# EAGLE design preamp (EAGLE 7.3.0)
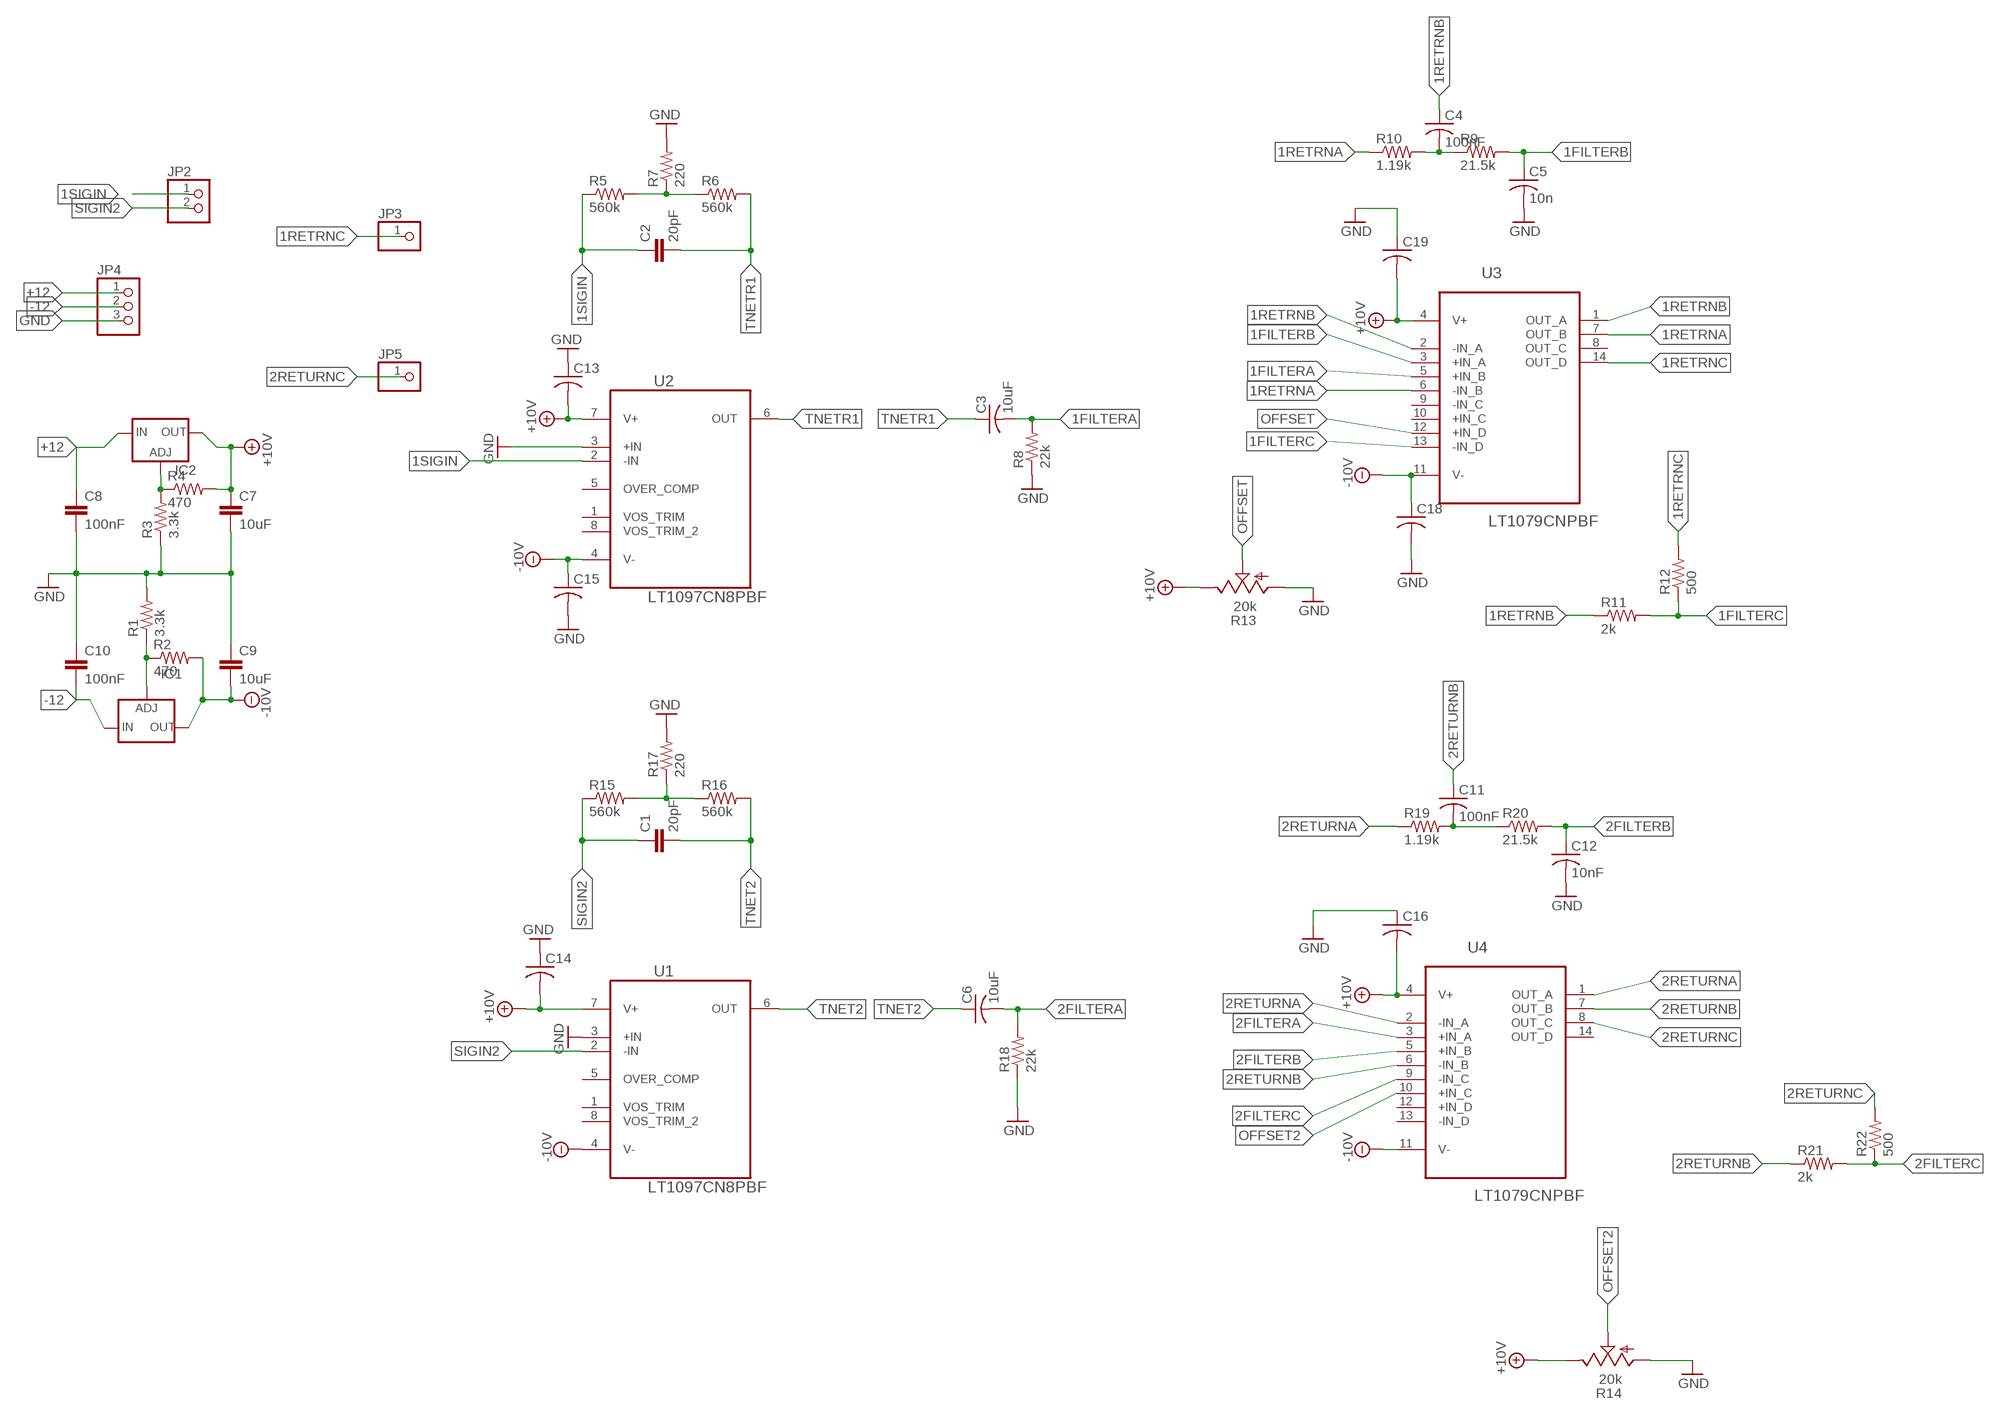
[diagram p0: schematic, sheet 1]

## Parts
C1  20pF  C-EU025-030X050  [C025-030X050]
C2  20pF  C-EU025-030X050  [C025-030X050]
C3  10uF  C-US050-030X075  [C050-030X075]
C4  100nF  C-US050-024X044  [C050-024X044]
C5  10n  C-US025-024X044  [C025-024X044]
C6  10uF  C-US050-030X075  [C050-030X075]
C7  10uF  C-EU025-025X050  [C025-025X050]
C8  100nF  C-EU025-025X050  [C025-025X050]
C9  10uF  C-EU025-025X050  [C025-025X050]
C10  100nF  C-EU025-025X050  [C025-025X050]
C11  100nF  C-US050-024X044  [C050-024X044]
C12  10nF  C-US025-024X044  [C025-024X044]
C13  C-US025-024X044  [C025-024X044]
C14  C-US025-024X044  [C025-024X044]
C15  C-US025-024X044  [C025-024X044]
C16  C-US025-024X044  [C025-024X044]
C18  C-US025-024X044  [C025-024X044]
C19  C-US025-024X044  [C025-024X044]
IC1  LM337TS  [337TS]
IC2  LM317TS  [317TS]
JP2  PINHD-1X2  [1X02]
JP3  PINHD-1X1  [1X01]
JP4  PINHD-1X3  [1X03]
JP5  PINHD-1X1  [1X01]
R1  3.3k  R-US_0204/5  [0204/5]
R2  470  R-US_0204/5  [0204/5]
R3  3.3k  R-US_0204/5  [0204/5]
R4  470  R-US_0204/5  [0204/5]
R5  560k  R-US_0204/7  [0204/7]
R6  560k  R-US_0204/7  [0204/7]
R7  220  R-US_0204/7  [0204/7]
R8  22k  R-US_0204/5  [0204/5]
R9  21.5k  R-US_0204/5  [0204/5]
R10  1.19k  R-US_0204/5  [0204/5]
R11  2k  R-US_0204/5  [0204/5]
R12  500  R-US_0204/5  [0204/5]
R13  20k  TRIM_US-B64W  [B64W]
R14  20k  TRIM_US-B64W  [B64W]
R15  560k  R-US_0204/7  [0204/7]
R16  560k  R-US_0204/7  [0204/7]
R17  220  R-US_0204/7  [0204/7]
R18  22k  R-US_0204/5  [0204/5]
R19  1.19k  R-US_0204/5  [0204/5]
R20  21.5k  R-US_0204/5  [0204/5]
R21  2k  R-US_0204/5  [0204/5]
R22  500  R-US_0204/5  [0204/5]
U1  LT1097CN8PBF  [DIP254P762X393-8]
U2  LT1097CN8PBF  [DIP254P762X393-8]
U3  LT1079CNPBF  [DIP254P762X394-14]
U4  LT1079CNPBF  [DIP254P762X394-14]

## Nets
1FILTERA: C3.2 R8.2 U3.5(+IN_B)
1FILTERB: C5.1 R9.2 U3.3(+IN_A)
1FILTERC: R11.2 R12.1 U3.13(-IN_D)
1RETRNA: R10.1 U3.6(-IN_B) U3.7(OUT_B)
1RETRNB: C4.1 R11.1 U3.1(OUT_A) U3.2(-IN_A)
1RETRNC: JP3.1 R12.2 U3.14(OUT_D)
1SIGIN: C2.1 JP2.1 R5.1 U2.2(-IN)
2FILTERA: C6.2 R18.2 U4.3(+IN_A)
2FILTERB: C12.1 R20.2 U4.5(+IN_B)
2FILTERC: R21.2 R22.1 U4.9(-IN_C)
2RETURNA: R19.1 U4.1(OUT_A) U4.2(-IN_A)
2RETURNB: C11.1 R21.1 U4.6(-IN_B) U4.7(OUT_B)
2RETURNC: JP5.1 R22.2 U4.8(OUT_C)
+10V: C7.1 C13.2 C14.2 C16.2 C19.2 IC2.2(OUT) R4.2 R13.E R14.E U1.7(V+) U2.7(V+) U3.4(V+) U4.4(V+)
+12: C8.1 IC2.3(IN) JP4.1
-10V: C9.2 C15.1 C18.1 IC1.3(OUT) R2.2 U1.4(V-) U2.4(V-) U3.11(V-) U4.11(V-)
-12: C10.2 IC1.2(IN) JP4.2
GND: C5.2 C7.2 C8.2 C9.1 C10.1 C12.2 C13.1 C14.1 C15.2 C16.1 C18.2 C19.1 JP4.3 R1.2 R3.1 R7.2 R8.1 R13.A R14.A R17.2 R18.1 U1.3(+IN) U2.3(+IN)
N$1: IC2.1(ADJ) R3.2 R4.1
N$2: IC1.1(ADJ) R1.1 R2.1
N$3: R5.2 R6.1 R7.1
N$4: C4.2 R9.1 R10.2
N$5: R15.2 R16.1 R17.1
N$19: C11.2 R19.2 R20.1
OFFSET: R13.S U3.12(+IN_D)
OFFSET2: R14.S U4.10(+IN_C)
SIGIN2: C1.1 JP2.2 R15.1 U1.2(-IN)
TNET2: C1.2 C6.1 R16.2 U1.6(OUT)
TNETR1: C2.2 C3.1 R6.2 U2.6(OUT)
Unconnected: U1.1(VOS_TRIM) U1.5(OVER_COMP) U1.8(VOS_TRIM_2) U2.1(VOS_TRIM) U2.5(OVER_COMP) U2.8(VOS_TRIM_2) U3.8(OUT_C) U3.9(-IN_C) U3.10(+IN_C) U4.12(+IN_D) U4.13(-IN_D) U4.14(OUT_D)

## Library data of the parts
C1 C2 C7-C10 = resistor:C-EU: CAPACITOR, European symbol
C3-C6 C11 C12 = resistor:C-US: CAPACITOR, American symbol
C13-C16 C18 C19 = rcl:C-US: CAPACITOR, American symbol
IC1 = v-reg:LM337TS: VOLTAGE REGULATOR
IC2 = v-reg:LM317TS: VOLTAGE REGULATOR
JP2 = pinhead:PINHD-1X2: PIN HEADER
JP3 JP5 = pinhead:PINHD-1X1: PIN HEADER
JP4 = pinhead:PINHD-1X3: PIN HEADER
R1-R12 R15-R22 = resistor:R-US_: RESISTOR, American symbol
R13 R14 = pot:TRIM_US-: POTENTIOMETER
U1 U2 = LTC_By_element14_Batch_1:LT1097CN8PBF: Precision Op Amp; MPN: LT1097CN8#PBF; OC_FARNELL: 9559914; OC_NEWARK: 57M1574; PACKAGE: PDIP; SUPPLIER: LINEAR TECHNOLOGY
U3 U4 = LTC_By_element14_Batch_1:LT1079CNPBF: Precision Op Amps; MPN: LT1079CN#PBF; OC_FARNELL: 9559701; OC_NEWARK: 57M1426; PACKAGE: PDIP-14; SUPPLIER: Linear Technology

## Board
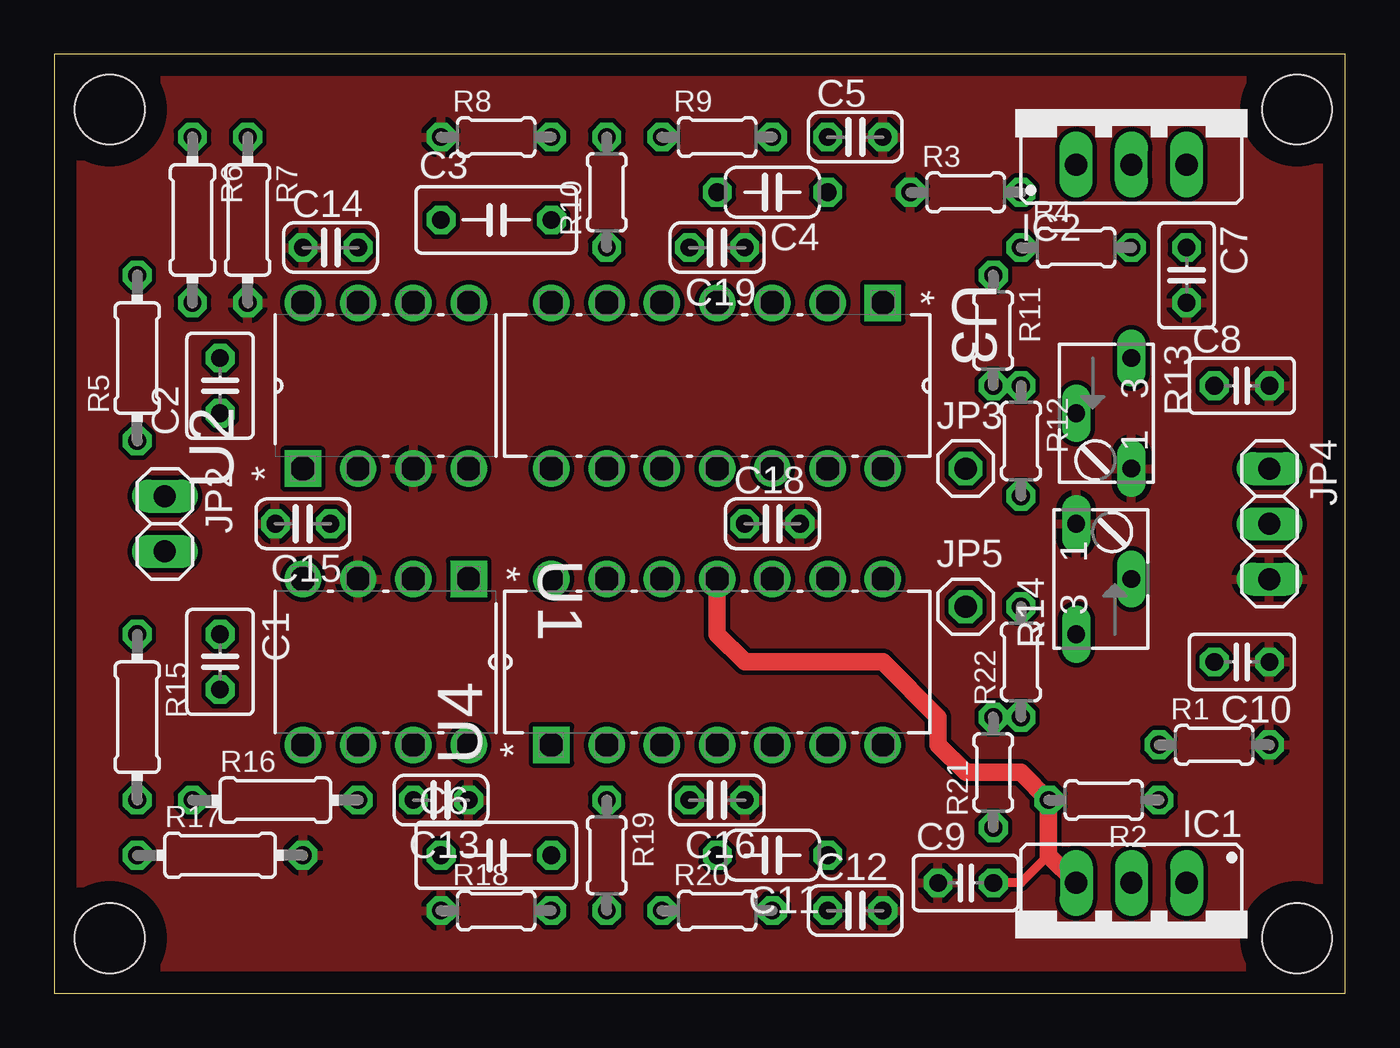
[diagram p1: board, top side]
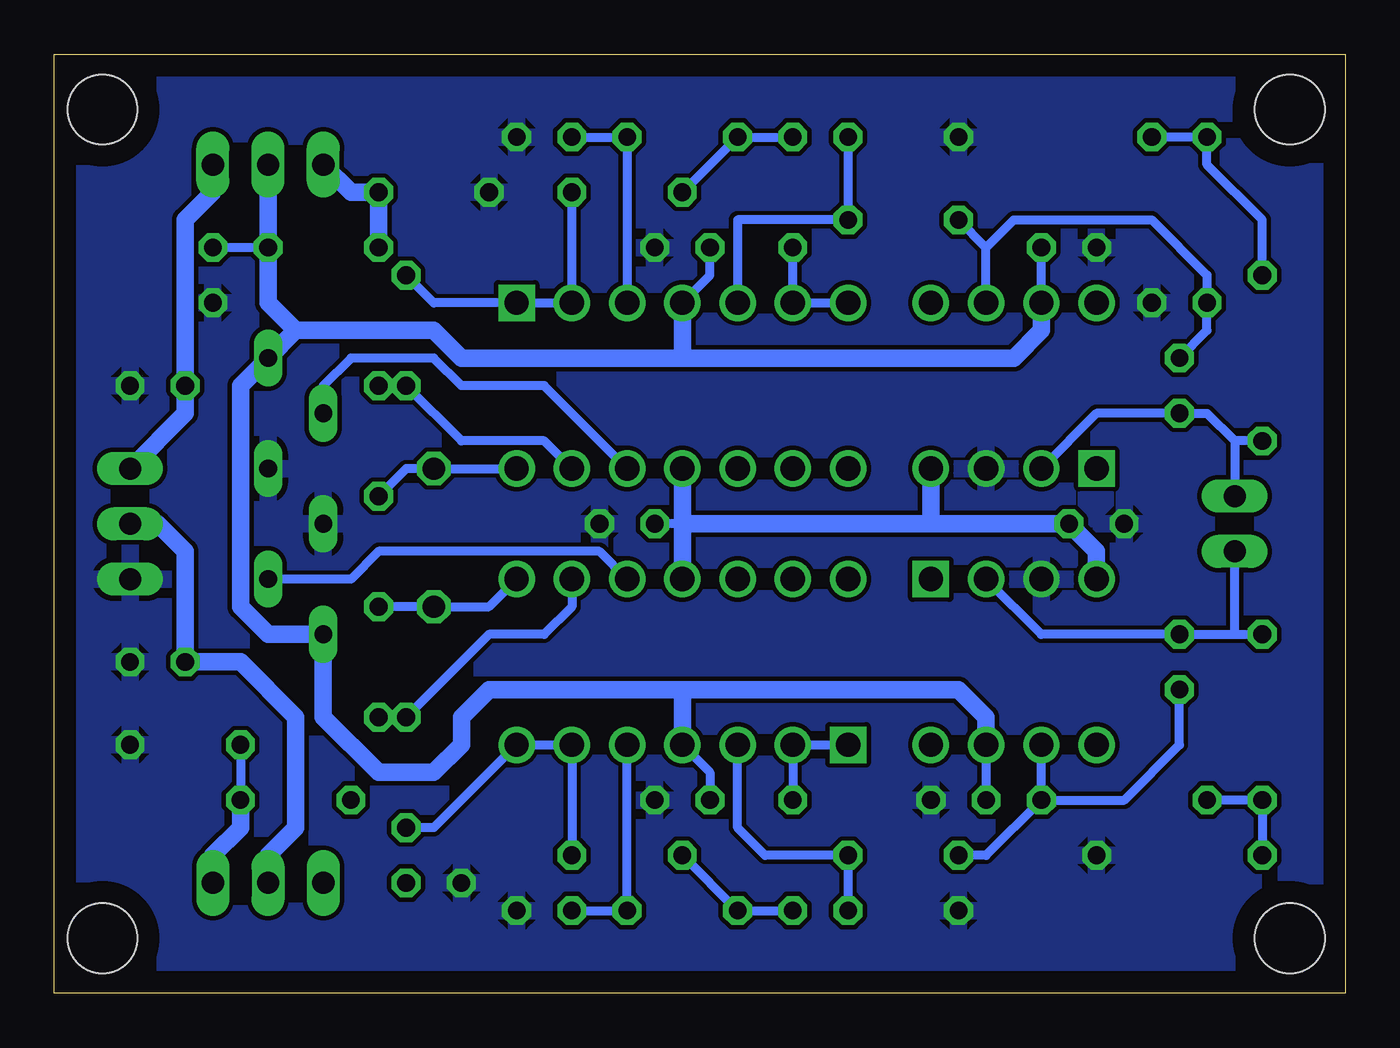
[diagram p2: board, bottom side, seen from below]

Size 59.36 x 43.17 mm. Coordinates in mm from the lower left corner, seen from the top.
Outline: 0,0 59.36,0 59.36,43.17 0,43.17 0,0
Copper layers (1*16): Top 0.035mm / dielectric 1.5mm / Bottom 0.035mm
Design rules "default *": minimum track width 16mil, minimum drill 24mil, track to track 8mil, track to pad 8mil, pad to pad 8mil, via to via 8mil, smd to smd 8mil, copper to edge 40mil, drill to drill 8mil, minimum pad ring 10mil, minimum via ring 8mil, stop-mask expansion 4mil, vias tented up to drill 0mil, thermal gap 10mil
Holes 3.2 mm at 2.54,40.64 57.15,40.64 57.15,2.54 2.54,2.54

### Footprints (pad centres in the part's own frame; a part is rotated, then mirrored left to right if it is on the bottom)
C025-030X050 = drill 0.813 octagon: 1 -1.27,0; 2 1.27,0
C050-030X075 = drill 0.813 octagon: 1 -2.54,0; 2 2.54,0
C050-024X044 = drill 0.813 octagon: 1 -2.54,0; 2 2.54,0
C025-024X044 = drill 0.813 octagon: 1 -1.27,0; 2 1.27,0
C025-025X050 = drill 0.813 octagon: 1 -1.27,0; 2 1.27,0
337TS = drill 1.016 long: 1 -2.54,-2.54; 2 0,-2.54; 3 2.54,-2.54
317TS = drill 1.016 long: 1 -2.54,-2.54; 2 0,-2.54; 3 2.54,-2.54
1X02 = drill 1.016 long: 1 -1.27,0; 2 1.27,0
1X01 = drill 1.016 octagon: 1 0,0
1X03 = drill 1.016 long: 1 -2.54,0; 2 0,0; 3 2.54,0
0204/5 = drill 0.813 octagon: 1 -2.54,0; 2 2.54,0
0204/7 = drill 0.813 octagon: 1 -3.81,0; 2 3.81,0
B64W = drill 0.813 long: A 2.54,0; E -2.54,0; S 0,-2.54
DIP254P762X393-8 = drill 1.118 square: 1 -7.62,7.62 | drill 1.118: 2 -7.62,5.08; 3 -7.62,2.54; 4 -7.62,0; 5 0,0; 6 0,2.54; 7 0,5.08; 8 0,7.62
DIP254P762X394-14 = drill 1.118 square: 1 -7.62,15.24 | drill 1.118: 2 -7.62,12.7; 3 -7.62,10.16; 4 -7.62,7.62; 5 -7.62,5.08; 6 -7.62,2.54; 7 -7.62,0; 8 0,0; 9 0,2.54; 10 0,5.08; 11 0,7.62; 12 0,10.16; 13 0,12.7; 14 0,15.24

### Placement (x,y rotation side)
C1  7.62,15.24 270 top
C2  7.62,27.94 90 top
C3  20.32,35.56 0 top
C4  33.02,36.83 180 top
C5  36.83,39.37 0 top
C6  20.32,6.35 0 top
C7  52.07,33.02 270 top
C8  54.61,27.94 0 top
C9  41.91,5.08 0 top
C10  54.61,15.24 180 top
C11  33.02,6.35 180 top
C12  36.83,3.81 0 top
C13  17.78,8.89 180 top
C14  12.7,34.29 0 top
C15  11.43,21.59 180 top
C16  30.48,8.89 180 top
C18  33.02,21.59 0 top
C19  30.48,34.29 180 top
IC1  49.53,2.54 180 top
IC2  49.53,40.64 0 top
JP2  5.08,21.59 270 top
JP3  41.91,24.13 0 top
JP4  55.88,21.59 270 top
JP5  41.91,17.78 0 top
R1  53.34,11.43 0 top
R2  48.26,8.89 180 top
R3  41.91,36.83 0 top
R4  46.99,34.29 0 top
R5  3.81,29.21 90 top
R6  6.35,35.56 270 top
R7  8.89,35.56 270 top
R8  20.32,39.37 0 top
R9  30.48,39.37 0 top
R10  25.4,36.83 90 top
R11  43.18,30.48 270 top
R12  44.45,25.4 270 top
R13  49.53,26.67 270 top
R14  46.99,19.05 90 top
R15  3.81,12.7 270 top
R16  10.16,8.89 0 top
R17  7.62,6.35 0 top
R18  20.32,3.81 0 top
R19  25.4,6.35 270 top
R20  30.48,3.81 0 top
R21  43.18,10.16 90 top
R22  44.45,15.24 90 top
U1  11.43,11.43 270 top
U2  19.05,31.75 90 top
U3  22.86,24.13 270 top
U4  38.1,19.05 90 top

### Tracks (layer width: path | path; a pad name or v marks a point on that pad's centre or on a via)
1FILTERA
  Bottom 0.406: R8.2 C3.2 27.94,35.56 U3.5
1FILTERB
  Bottom 0.406: C5.1 R9.2 U3.3
1FILTERC
  Top 0.406: R12.1 R11.2
  Bottom 0.406: R11.2 40.64,25.4 36.83,25.4 U3.13
1RETRNA
  Bottom 0.406: R10.1 U3.6 U3.7
1RETRNB
  Bottom 0.406: C4.1 U3.2 U3.1 41.91,31.75 R11.1
1RETRNC
  Bottom 0.406: R12.2 43.18,24.13 JP3.1 U3.14
1SIGIN
  Bottom 0.406: 5.08,25.4 6.35,26.67 C2.1 11.43,26.67 U2.2 | 5.08,25.4 JP2.1 | R5.1 5.08,25.4
2FILTERA
  Bottom 0.406: R18.2 C6.2 26.67,6.35 27.94,7.62 U4.3
2FILTERB
  Bottom 0.406: C12.1 R20.2 U4.5
2FILTERC
  Top 0.406: R22.1 R21.2
  Bottom 0.406: U4.9 35.56,17.78 36.83,16.51 39.37,16.51 R21.2
2RETURNA
  Bottom 0.406: R19.1 U4.2 U4.1
2RETURNB
  Bottom 0.406: C11.1 U4.6 U4.7 41.91,7.62 R21.1
2RETURNC
  Bottom 0.406: R22.2 JP5.1 39.37,17.78 U4.8
+10V
  Bottom 0.406: U1.7 C13.2 | U3.4 29.21,33.02 C19.2 | U4.4 29.21,10.16 C16.2 | R4.2 C7.1 | U2.7 C14.2
  Bottom 0.813: 30.48,29.21 15.24,29.21 13.97,30.48 U2.7 | U3.4 30.48,29.21 | U1.7 16.51,12.7 17.78,13.97 30.48,13.97 | 48.26,30.48 41.91,30.48 40.64,29.21 30.48,29.21 | 48.26,30.48 R13.E 50.8,27.94 50.8,17.78 49.53,16.51 R14.E 46.99,12.7 44.45,10.16 41.91,10.16 40.64,11.43 40.64,12.7 39.37,13.97 30.48,13.97 | U4.4 30.48,13.97 | 48.26,30.48 49.53,31.75 R4.2 IC2.2
+12
  Bottom 0.813: JP4.1 53.34,26.67 C8.1 53.34,35.56 52.07,36.83 IC2.3
-10V
  Top 0.406: 45.72,6.35 44.45,5.08 C9.2
  Top 0.813: U4.11 30.48,16.51 31.75,15.24 38.1,15.24 40.64,12.7 40.64,11.43 41.91,10.16 44.45,10.16 R2.2 45.72,6.35 IC1.3
  Bottom 0.406: 30.48,21.59 C18.1
  Bottom 0.813: 19.05,21.59 C15.1 11.43,20.32 U1.4 | 19.05,21.59 30.48,21.59 | 30.48,21.59 U3.11 | 30.48,21.59 U4.11 | U2.4 19.05,21.59
-12
  Bottom 0.813: JP4.2 54.61,21.59 53.34,20.32 C10.2 50.8,15.24 48.26,12.7 48.26,7.62 49.53,6.35 IC1.2
GND
  pour Top: -1.27,44.45 60.96,44.45 60.96,-1.27 -1.27,-1.27
  pour Bottom: 5.08,54.61 5.08,50.8 1.27,50.8 1.27,3.81 5.08,3.81 5.08,1.27 80.01,1.27 80.01,5.08 83.82,5.08 83.82,50.8 80.01,50.8 80.01,54.61
N$1
  Bottom 0.813: R4.1 R3.2 45.72,36.83 IC2.1
N$2
  Bottom 0.406: R1.1 R2.1
  Bottom 0.813: R2.1 50.8,7.62 52.07,6.35 IC1.1
N$3
  Bottom 0.406: R5.2 3.81,35.56 6.35,38.1 R6.1 R7.1
N$4
  Bottom 0.406: R10.2 R9.1 C4.2
N$5
  Bottom 0.406: R17.1 R15.2 R16.1
N$19
  Bottom 0.406: R19.2 R20.1 C11.2
OFFSET
  Bottom 0.406: R13.S 46.99,27.94 45.72,29.21 41.91,29.21 40.64,27.94 36.83,27.94 U3.12
OFFSET2
  Bottom 0.406: U4.10 34.29,20.32 44.45,20.32 45.72,19.05 R14.S
SIGIN2
  Bottom 0.406: 5.08,16.51 C1.1 13.97,16.51 U1.2 | 5.08,16.51 R15.1 | 5.08,16.51 JP2.2
TNET2
  Bottom 0.406: R16.2 10.16,8.89 7.62,11.43 C1.2 | C6.1 16.51,6.35 R16.2 | R16.2 U1.6
TNETR1
  Bottom 0.406: 16.51,34.29 C3.1 | C2.2 6.35,30.48 R6.2 6.35,33.02 8.89,35.56 15.24,35.56 16.51,34.29 | U2.6 16.51,34.29